# EAGLE schematic STM32F030 - VGA minimal v4 (EAGLE 6.5.0)
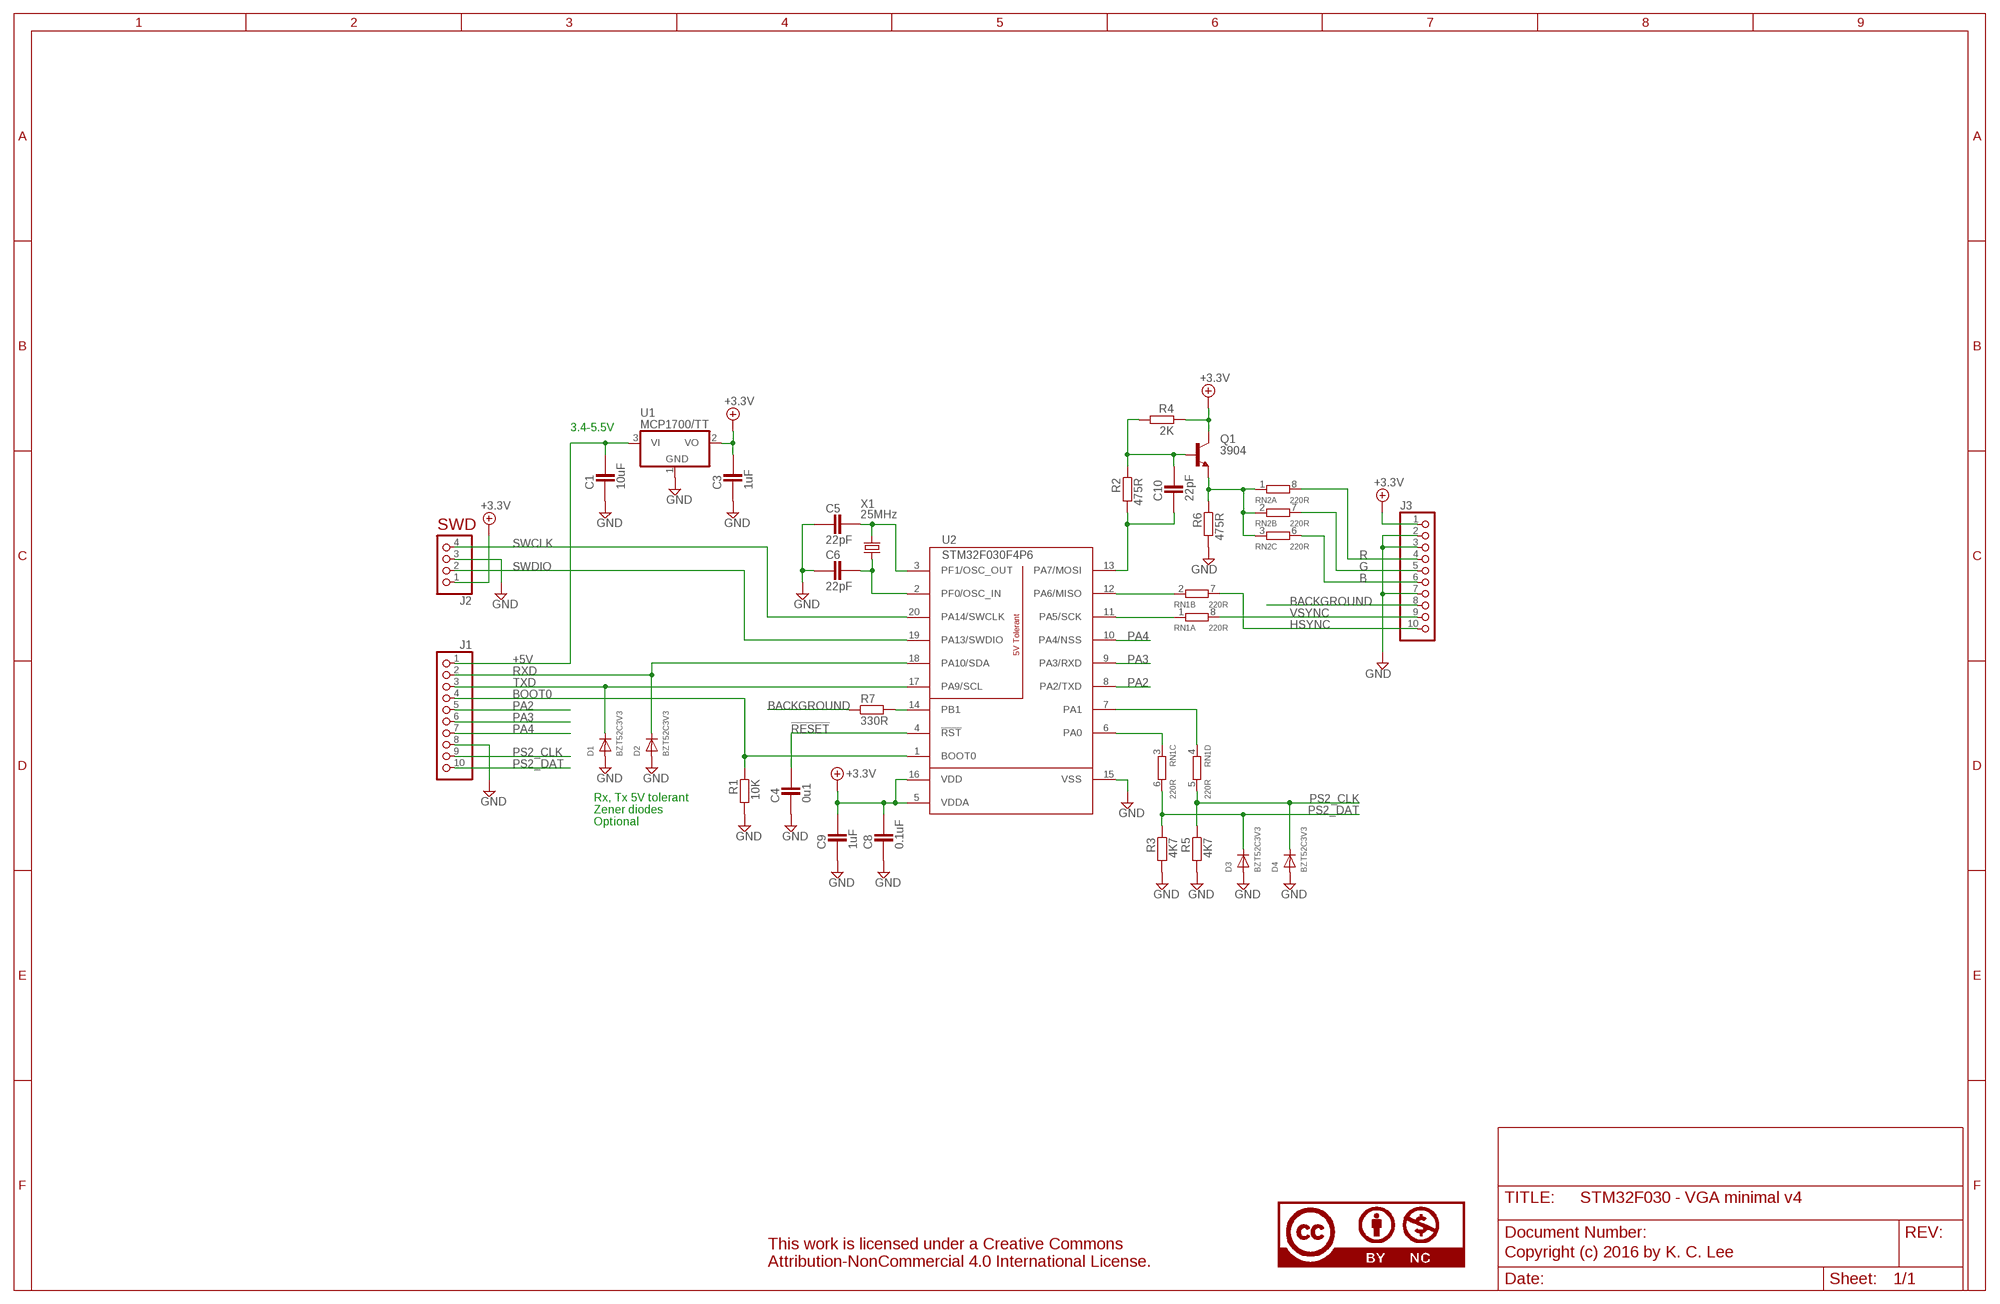
[diagram p0: schematic, sheet 1]

## Parts
C1  10uF  CAPACITOR_0805  [CAPC2012X145AN]
C3  1uF  CAPACITOR_0805  [CAPC2012X145AN]
C4  0u1  CAPACITOR_0603  [CAPC1608X92N]
C5  22pF  CAPACITOR_0603  [CAPC1608X92N]
C6  22pF  CAPACITOR_0603  [CAPC1608X92N]
C8  0.1uF  CAPACITOR_0603  [CAPC1608X92N]
C9  1uF  CAPACITOR_0603  [CAPC1608X92N]
C10  22pF  CAPACITOR_0603  [CAPC1608X92N]
D1  BZT52C3V3  DIODESOD-123  [SOD-123]
D2  BZT52C3V3  DIODESOD-123  [SOD-123]
D3  BZT52C3V3  DIODESOD-123  [SOD-123]
D4  BZT52C3V3  DIODESOD-123  [SOD-123]
J1  PINHD-1X10  [1X10]
J2  PINHD-1X4_2.54  [1X04]
J3  PINHD-1X10  [1X10]
Q1  3904  NPN_SOT-23  [SOT95P280X135-3N]
R1  10K  RESISTOR_0603  [RESC1608X55N]
R2  475R  RESISTOR_0603  [RESC1608X55N]
R3  4K7  RESISTOR_0603  [RESC1608X55N]
R4  2K  RESISTOR_0603  [RESC1608X55N]
R5  4K7  RESISTOR_0603  [RESC1608X55N]
R6  475R  RESISTOR_0603  [RESC1608X55N]
R7  330R  RESISTOR_0603  [RESC1608X55N]
RN1  220R  4R-NCAT16  [CAT16]
RN2  220R  4R-NCAT16  [CAT16]
U1  MCP1700/TT  [SOT95P280X135-3N]
U2  STM32F030F4P6  [TSSOP20]
U$1  CC-BY-NC75%  [CC-BY-NC-75]
X1  25MHz  CRYSTALSM49  [SM49]

## Nets
!RESET: C4.2 U2.4(!RST)
+3.3V: C3.2 C8.2 C9.2 J2.1 J3.1 Q1.3(C) R4.1 U1.2(VO) U2.5(VDDA) U2.16(VDD)
+5V: C1.2 J1.1 U1.3(VI)
B: J3.6 RN2.6
BACKGROUND: J3.8 R7.1
BOOT0: J1.4 R1.1 U2.1(BOOT0)
G: J3.5 RN2.7
GND: C1.1 C3.1 C4.1 C5.1 C6.1 C8.1 C9.1 D1.A D2.A D3.A D4.A J1.8 J2.3 J3.2 J3.3 J3.7 R1.2 R3.2 R5.2 R6.2 U1.1(GND) U2.15(VSS)
HSYNC: J3.10 RN1.7
N$1: Q1.2(E) R6.1 RN2.1 RN2.2 RN2.3
N$2: RN1.2 U2.12(PA6/MISO)
N$3: RN1.4 U2.7(PA1)
N$4: R7.2 U2.14(PB1)
N$5: C5.2 U2.3(PF1/OSC_OUT) X1.2
N$6: C6.2 U2.2(PF0/OSC_IN) X1.1
N$8: RN1.1 U2.11(PA5/SCK)
N$9: RN1.3 U2.6(PA0)
N$11: C10.2 Q1.1(B) R2.1 R4.2
N$12: C10.1 R2.2 U2.13(PA7/MOSI)
PA2: J1.5 U2.8(PA2/TXD)
PA3: J1.6 U2.9(PA3/RXD)
PA4: J1.7 U2.10(PA4/NSS)
PS2_CLK: D4.C J1.9 R5.1 RN1.5
PS2_DAT: D3.C J1.10 R3.1 RN1.6
R: J3.4 RN2.8
RXD: D2.C J1.2 U2.18(PA10/SDA)
SWCLK: J2.4 U2.20(PA14/SWCLK)
SWDIO: J2.2 U2.19(PA13/SWDIO)
TXD: D1.C J1.3 U2.17(PA9/SCL)
VSYNC: J3.9 RN1.8
Unconnected: RN2.4 RN2.5

## Notes on the sheet
- 3.4-5.5V
- SWD
- Rx, Tx 5V tolerant
  Zener diodes
  Optional
- Copyright (c) 2016 by K. C. Lee

## Library data of the parts
C1 C3-C6 C9 C10 = ipc-7351-capacitor:CAPACITOR_; PARTNO: 0U1, 0603
C8 = ipc-7351-capacitor:CAPACITOR_; PARTNO: 1UF, 0603
D1-D4 = Misc Passives:DIODE: Diode SMADIODE - SMA Surface Mount Package 20V 1A Schottky Diode Digikey (500mV @ 1A, 500uA Vr @ 20V): 641-1014-6-ND SOD-123 30V 500mA (430mV Vf, 130uA Vr @ 30V) Schottky Diode - Digikey: B0530W-FDICT-ND SOD-323 10V 570mA (380mV Vf, 3ns) Schottky Diode - Digikey: ZLLS410CT-ND SOD-523 30V 30mA Schottky Diode (RB751S-40TE61) - Digikey: RB751S-40TE61CT-ND SOT23-R/W - SOT23 Package (R = Solder Paste/Reflow Ovens, W = Hand-Soldering) BAT54Film 40V 300mA - Digikey: 497-7162-1-ND DO-1N4148 Through Hole Small Current Diode (any model)
J1 J3 = Misc Conn:PINHD-1X10: PIN HEADER
J2 = Misc Conn:PINHD-1X4: PIN HEADER
Q1 = ipc-7351-transistor:NPN_
R1-R7 = ipc-7351-resistor:RESISTOR_; PARTNO: 10K, 0603
RN1 RN2 = Misc Passives:4R-N: Array Chip Resistor Source: RS Component / Phycomp; OC_FARNELL: unknown; OC_NEWARK: unknown
U1 = Misc Power:MCP1700
U2 = Misc Processor:STM32F030F4P6; PARTNO: STM32F030F4P6
U$1 = Misc logo:CC-BY-NC
X1 = crystal:CRYSTAL: CRYSTAL; OC_FARNELL: unknown; OC_NEWARK: unknown